# Altium schematic sheet Nucleo Shield.SchDoc
size A
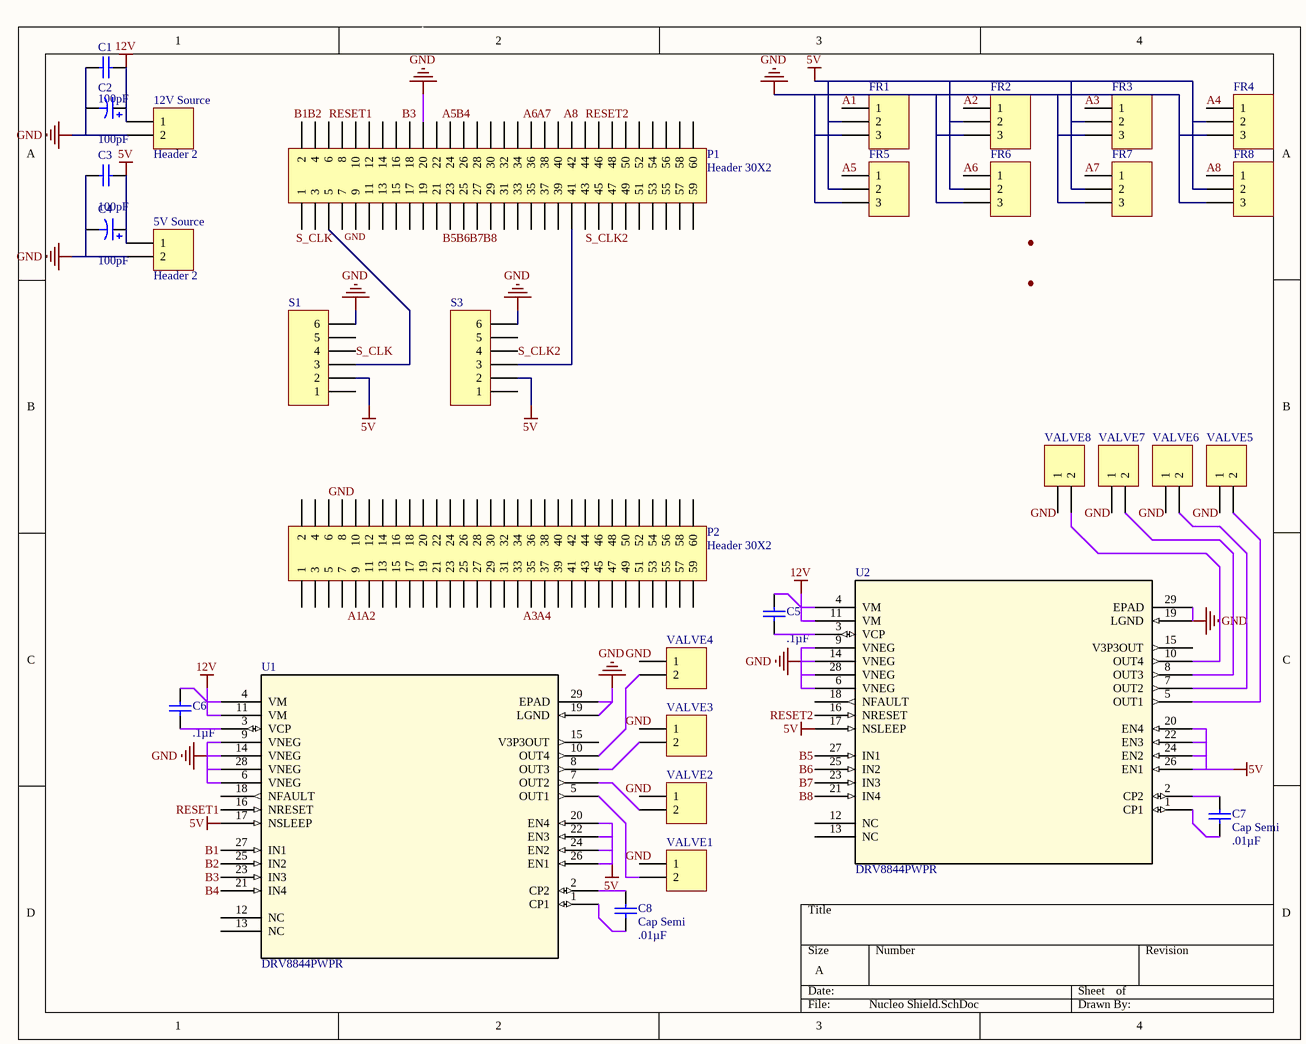
[diagram p0: Nucleo Shield.SchDoc]

## Parts
5V_Source  Header 2  [HDR1X2]
12V_Source  Header 2  [HDR1X2]
C1  value 100pF  [C1206]  (hidden comment: Cap Semi)
C2  value 100pF  [C0805]  (hidden comment: Cap Pol3)
C3  value 100pF  [C1206]  (hidden comment: Cap Semi)
C4  value 100pF  [C0805]  (hidden comment: Cap Pol3)
C5  value .1µF  [C1206]  (hidden comment: Cap Semi)
C6  value .1µF  [C1206]  (hidden comment: Cap Semi)
C7  Cap Semi  value .01µF  [C1206]
C8  Cap Semi  value .01µF  [C1206]
FR1  FlowRate Sense  [HDR1X3]  (value not drawn)
FR2  FlowRate Sense  [HDR1X3]  (value not drawn)
FR3  FlowRate Sense  [HDR1X3]  (value not drawn)
FR4  FlowRate Sense  [HDR1X3]  (value not drawn)
FR5  FlowRate Sense  [HDR1X3]  (value not drawn)
FR6  FlowRate Sense  [HDR1X3]  (value not drawn)
FR7  FlowRate Sense  [HDR1X3]  (value not drawn)
FR8  FlowRate Sense  [HDR1X3]  (value not drawn)
P1  Header 30X2  [HDR2X30]
P2  Header 30X2  [HDR2X30]
S1  Header 6  [HDR1X6]  (value not drawn)
S3  Header 6  [HDR1X6]  (value not drawn)
U1  DRV8844PWPR  [PWP28_5P18X3P1]
U2  DRV8844PWPR  [PWP28_5P18X3P1]
VALVE1  Header 2  [HDR1X2]  (value not drawn)
VALVE2  Header 2  [HDR1X2]  (value not drawn)
VALVE3  Header 2  [HDR1X2]  (value not drawn)
VALVE4  Header 2  [HDR1X2]  (value not drawn)
VALVE5  Header 2  [HDR1X2]  (value not drawn)
VALVE6  Header 2  [HDR1X2]  (value not drawn)
VALVE7  Header 2  [HDR1X2]  (value not drawn)
VALVE8  Header 2  [HDR1X2]  (value not drawn)

## Nets
5V: 5V_Source.1 C3.2 C4.1 FR1.2 FR2.2 FR3.2 FR4.2 FR5.2 FR6.2 FR7.2 FR8.2 S1.2 S3.2 U1.17(NSLEEP) U1.20(EN4) U1.22(EN3) U1.24(EN2) U1.26(EN1) U2.17(NSLEEP) U2.20(EN4) U2.22(EN3) U2.24(EN2) U2.26(EN1)
12V: 12V_Source.1 C1.2 C2.1 C5.2 C6.2 U1.4(VM) U1.11(VM) U2.4(VM) U2.11(VM)
GND: 5V_Source.2 12V_Source.2 C1.1 C2.2 C3.1 C4.2 FR1.3 FR2.3 FR3.3 FR4.3 FR5.3 FR6.3 FR7.3 FR8.3 P1.9 P1.20 P2.8 S1.6 S3.6 U1.6(VNEG) U1.9(VNEG) U1.14(VNEG) U1.19(LGND) U1.28(VNEG) U1.29(EPAD) U2.6(VNEG) U2.9(VNEG) U2.14(VNEG) U2.19(LGND) U2.28(VNEG) U2.29(EPAD) VALVE1.1 VALVE2.1 VALVE3.1 VALVE4.1 VALVE5.1 VALVE6.1 VALVE7.1 VALVE8.1
A1: FR1.1 P2.9
A2: FR2.1 P2.11
A3: FR3.1 P2.35
A4: FR4.1 P2.37
A5: FR5.1 P1.24
A6: FR6.1 P1.36
A7: FR7.1 P1.38
A8: FR8.1 P1.42
B1: P1.2 U1.27(IN1)
B2: P1.4 U1.25(IN2)
B3: P1.18 U1.23(IN3)
B4: P1.26 U1.21(IN4)
B5: P1.23 U2.27(IN1)
B6: P1.25 U2.25(IN2)
B7: P1.27 U2.23(IN3)
B8: P1.29 U2.21(IN4)
RESET1: P1.6 U1.16(NRESET)
RESET2: P1.44 U2.16(NRESET)
S_CLK: P1.3 S1.4
S_CLK2: P1.43 S3.4
NetC5_1: C5.1 U2.3(VCP)
NetC6_1: C6.1 U1.3(VCP)
NetC7_1: C7.1 U2.1(CP1)
NetC7_2: C7.2 U2.2(CP2)
NetC8_1: C8.1 U1.1(CP1)
NetC8_2: C8.2 U1.2(CP2)
NetP1_5: P1.5 S1.3
NetP1_41: P1.41 S3.3
NetU1_5: U1.5(OUT1) VALVE1.2
NetU1_7: U1.7(OUT2) VALVE2.2
NetU1_8: U1.8(OUT3) VALVE3.2
NetU1_10: U1.10(OUT4) VALVE4.2
NetU2_5: U2.5(OUT1) VALVE5.2
NetU2_7: U2.7(OUT2) VALVE6.2
NetU2_8: U2.8(OUT3) VALVE7.2
NetU2_10: U2.10(OUT4) VALVE8.2

Not connected (* = marked no-connect by the designer): P1 1 7 8 10 11 12 13 14 15 16 17 19 21 22 28 30 31 32 33 34 35 37 39 40 45 46 47 48 49 50 51 52 53 54 55 56 57 58 59 60; P2 1 2 3 4 5 6 7 10 12 13 14 15 16 17 18 19 20 21 22 23 24 25 26 27 28 29 30 31 32 33 34 36 38 39 40 41 42 43 44 45 46 47 48 49 50 51 52 53 54 55 56 57 58 59 60; S1 1 5; S3 1 5; U1 12(NC) 13(NC) 15(V3P3OUT) 18(NFAULT); U2 12(NC) 13(NC) 15(V3P3OUT) 18(NFAULT)

## Library data of the parts
5V_Source 12V_Source VALVE1-VALVE8 = Header 2: Header, 2-Pin; LatestRevisionDate: 17-Jul-2002; LatestRevisionNote: Re-released for DXP Platform.; Publisher: Altium Limited
C1 C3 C5-C8 = Cap Semi: Capacitor (Semiconductor SIM Model); Published: 8-Jun-2000; LatestRevisionDate: 29-May-2009; LatestRevisionNote: IPC-7351 Footprint Added.; PackageReference: C1206; Publisher: Altium Limited; PackageDescription: Chip Capacitor
C2 C4 = Cap Pol3: Polarized Capacitor (Surface Mount); Published: 8-Jun-2000; LatestRevisionDate: 29-May-2009; LatestRevisionNote: IPC-7351 Footprint Added.; PackageReference: C0805; Publisher: Altium Limited; PackageDescription: Chip Capacitor
FR1-FR8 = Header 3: Header, 3-Pin; LatestRevisionDate: 17-Jul-2002; LatestRevisionNote: Re-released for DXP Platform.; Publisher: Altium Limited
P1 P2 = Header 30X2: Header, 30-Pin, Dual row; LatestRevisionDate: 17-Jul-2002; LatestRevisionNote: Re-released for DXP Platform.; Publisher: Altium Limited
S1 S3 = Header 6: Header, 6-Pin; LatestRevisionDate: 17-Jul-2002; LatestRevisionNote: Re-released for DXP Platform.; Publisher: Altium Limited
U1 U2 = DRV8844PWPR: Imported; Vendor: Texas Instruments; Built_By: EMA_UL_Team; C: Copyright (C) 2015 Accelerated Designs. All rights reserved; Manufacturer_Part_Number: DRV8844PWPR; RefDes: RefDes; Type: DEV; Value: Value